# Altium schematic sheet Heating.SchDoc: High Current Heating System
size A; Author: Team WILDCARD; Revision: 1
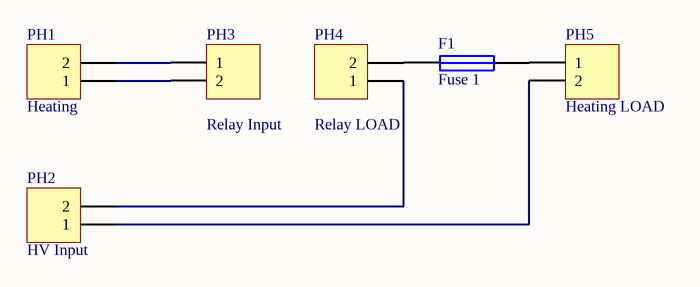
[diagram p0: Heating.SchDoc]

## Parts
F1  Fuse 1  [PIN-W2/E2.8]
PH1  Heating  [HDR1X2]
PH2  HV Input  [HDR1X2]
PH3  Relay Input  [HDR1X2]
PH4  Relay LOAD  [HDR1X2]
PH5  Heating LOAD  [HDR1X2]

## Nets
NetF1_1: F1.1 PH4.2
NetF1_2: F1.2 PH5.1
NetPH1_1: PH1.1 PH3.2
NetPH1_2: PH1.2 PH3.1
NetPH2_1: PH2.1 PH5.2
NetPH2_2: PH2.2 PH4.1

## Library data of the parts
F1 = Fuse 1: Fuse; Published: 8-Jun-2000; LatestRevisionDate: 17-Jul-2002; LatestRevisionNote: Re-released for DXP Platform.; PackageReference: PIN-W2/E2.8; Publisher: Altium Limited; PackageDescription: Thru-Hole; 2 Leads
PH1-PH5 = Header 2: Header, 2-Pin; LatestRevisionDate: 17-Jul-2002; LatestRevisionNote: Re-released for DXP Platform.; Publisher: Altium Limited